# Altium schematic sheet 1_BLE-T2_top.SchDoc
size A4
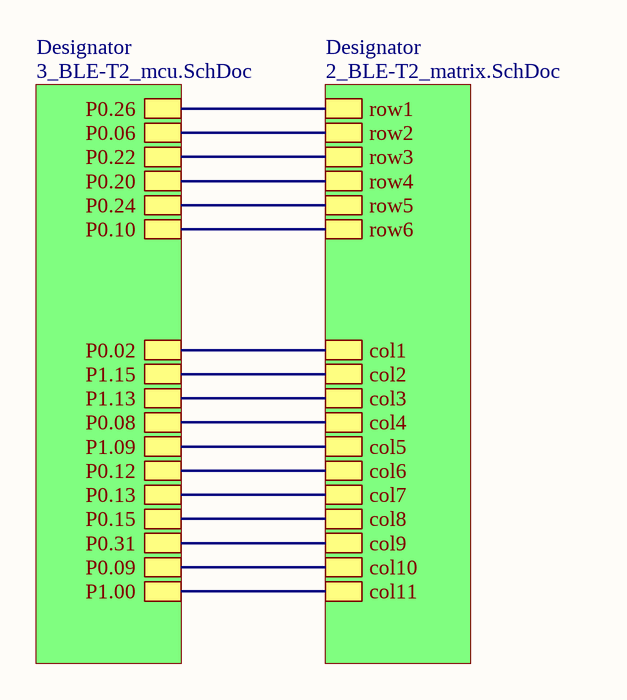
[diagram p0: 1_BLE-T2_top.SchDoc]

## Sub-sheets
Designator = 2_BLE-T2_matrix.SchDoc: col6, col8, col5, col7, col3, col2, col1, col4, row3, row1, row4, row2, row5, col11, col10, col9, row6
Designator = 3_BLE-T2_mcu.SchDoc: P0.24, P0.09, P1.15, P0.20, P1.00, P0.22, P1.13, P0.02, P0.10, P0.08, P0.06, P0.15, P0.13, P0.12, P1.09, P0.26, P0.31

## Nets
(unnamed): sheet Designator/col6, sheet Designator/P0.12
(unnamed): sheet Designator/col8, sheet Designator/P0.15
(unnamed): sheet Designator/col5, sheet Designator/P1.09
(unnamed): sheet Designator/col7, sheet Designator/P0.13
(unnamed): sheet Designator/col3, sheet Designator/P1.13
(unnamed): sheet Designator/col2, sheet Designator/P1.15
(unnamed): sheet Designator/col1, sheet Designator/P0.02
(unnamed): sheet Designator/col4, sheet Designator/P0.08
(unnamed): sheet Designator/row3, sheet Designator/P0.22
(unnamed): sheet Designator/row1, sheet Designator/P0.26
(unnamed): sheet Designator/row4, sheet Designator/P0.20
(unnamed): sheet Designator/row2, sheet Designator/P0.06
(unnamed): sheet Designator/row5, sheet Designator/P0.24
(unnamed): sheet Designator/col11, sheet Designator/P1.00
(unnamed): sheet Designator/col10, sheet Designator/P0.09
(unnamed): sheet Designator/col9, sheet Designator/P0.31
(unnamed): sheet Designator/row6, sheet Designator/P0.10